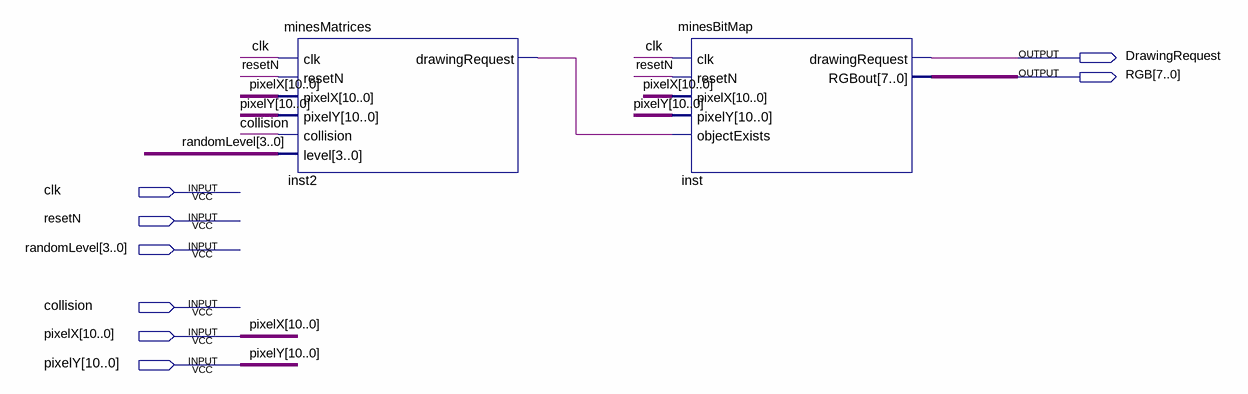
[diagram p0: schematic sheet]
// Quartus schematic minesTop.bdf as structural Verilog: 2 symbols, 8 pins
module minesTop (
  input  clk,
  input  resetN,
  input  [3:0] randomLevel,
  input  collision,
  input  [10:0] pixelX,
  input  [10:0] pixelY,
  output DrawingRequest,
  output [7:0] RGB
);

  wire inst2_drawingrequest;

  minesMatrices inst2 (
    .clk(clk), .resetN(resetN), .pixelX(pixelX), .pixelY(pixelY), .collision(collision), .level(randomLevel),
    .drawingRequest(inst2_drawingrequest));
  minesBitMap inst (
    .clk(clk), .resetN(resetN), .pixelX(pixelX), .pixelY(pixelY), .objectExists(inst2_drawingrequest),
    .drawingRequest(DrawingRequest), .RGBout(RGB));
endmodule
